# EAGLE design LaserPowerMeter (EAGLE 7.2.0)
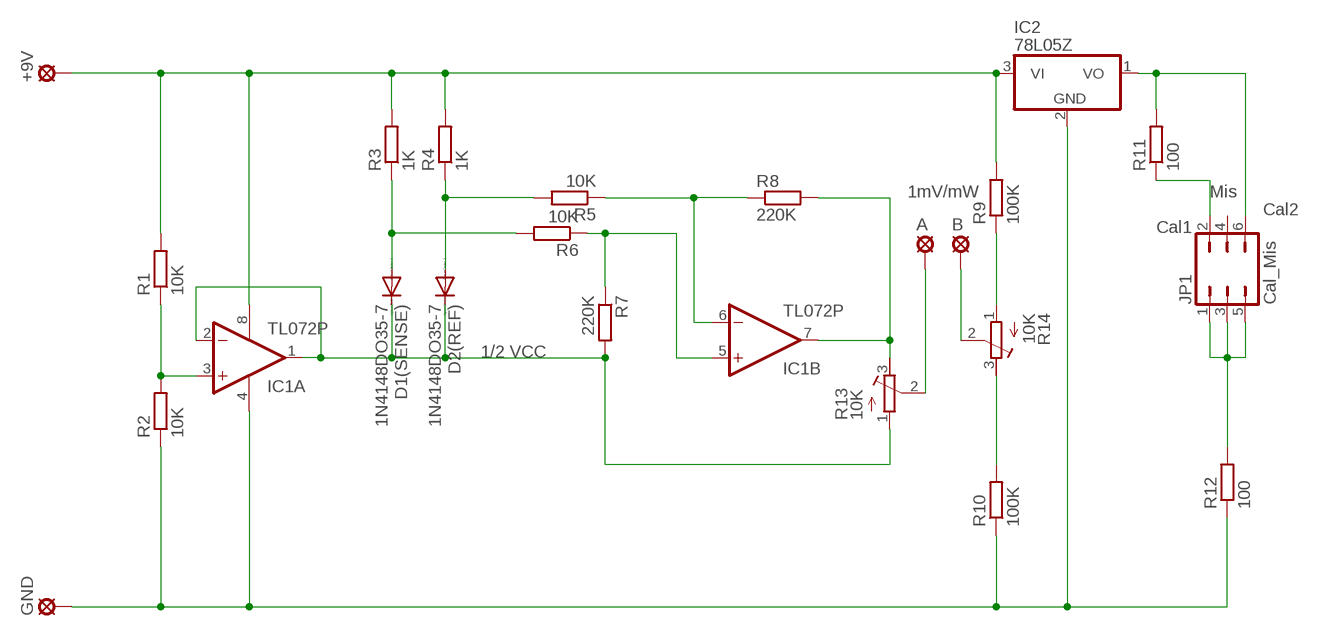
[diagram p0: schematic, sheet 1]

## Parts
+9V  LSP10  [LSP10]
A  LSP10  [LSP10]
B  LSP10  [LSP10]
D1(SENSE)  1N4148DO35-7  [DO35-7]
D2(REF)  1N4148DO35-7  [DO35-7]
GND  LSP10  [LSP10]
IC1  TL072P  [DIL08]
IC2  78L05Z  [TO92]
JP1  Cal_Mis  JP3Q  [JP3Q]
R1  10K  R-EU_0204/7  [0204/7]
R2  10K  R-EU_0204/7  [0204/7]
R3  1K  R-EU_0204/7  [0204/7]
R4  1K  R-EU_0204/7  [0204/7]
R5  10K  R-EU_0204/7  [0204/7]
R6  10K  R-EU_0204/7  [0204/7]
R7  220K  R-EU_0204/7  [0204/7]
R8  220K  R-EU_0204/7  [0204/7]
R9  100K  R-EU_0204/7  [0204/7]
R10  100K  R-EU_0204/7  [0204/7]
R11  100  R-EU_0204/7  [0204/7]
R12  100  R-EU_0204/7  [0204/7]
R13  10K  R-TRIMM3339P  [RTRIM3339P]
R14  10K  R-TRIMM3339P  [RTRIM3339P]

## Nets
N$2: JP1.1 JP1.3 JP1.5 R12.2
N$3: GND.MP IC1.4(P:V-) IC2.2(GND) R2.1 R10.1 R12.1
N$4: IC1.3(A:+IN) R1.1 R2.2
N$5: IC2.1(VO) JP1.6 R11.2
N$6: JP1.2 R11.1
N$7: +9V.MP IC1.8(P:V+) IC2.3(VI) R1.2 R3.2 R4.2 R9.2
N$8: R9.1 R14.1(A)
N$9: R10.2 R14.3(E)
N$10: A.MP R13.2(S)
N$11: B.MP R14.2(S)
N$12: IC1.7(B:OUT) R8.2 R13.3(E)
N$13: D1(SENSE).A R3.1 R6.2
N$14: D2(REF).A R4.1 R5.2
N$15: IC1.6(B:-IN) R5.1 R8.1
N$16: IC1.5(B:+IN) R6.1 R7.1
N$17: D1(SENSE).C D2(REF).C IC1.1(A:OUT) IC1.2(A:-IN) R7.2 R13.1(A)
Unconnected: JP1.4

## Notes on the sheet
- 1mV/mW | Mis
- Cal2
- Cal1
- 1/2 VCC

## Library data of the parts
+9V A B GND = solpad:LSP10: SOLDER PAD drill 1.0 mm, distributor Buerklin, 12H555
D1(SENSE) D2(REF) = diode:1N4148: DIODE high speed (Philips)
IC1 = linear:TL072: OP AMP
IC2 = linear:78*: Positive VOLTAGE REGULATOR Source: http://cache.national.com/ds/LM/LM78L05.pdf http://www.fairchildsemi.com/ds/LM/LM7805.pdf
JP1 = jumper:JP3Q: JUMPER
R1-R12 = rcl:R-EU_: RESISTOR, European symbol
R13 R14 = rcl:R-TRIMM: Trimm resistor

## Board
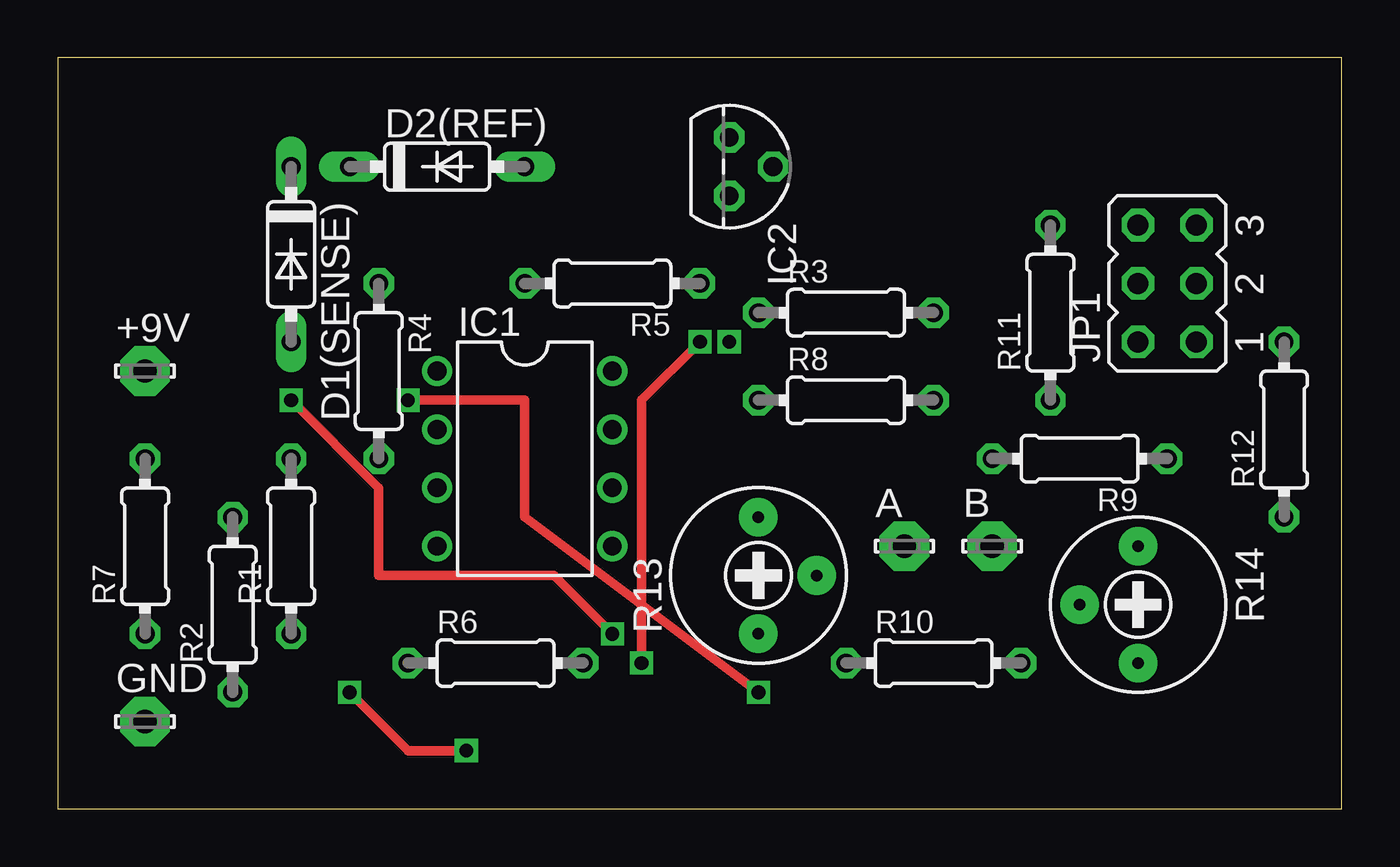
[diagram p1: board, top side]
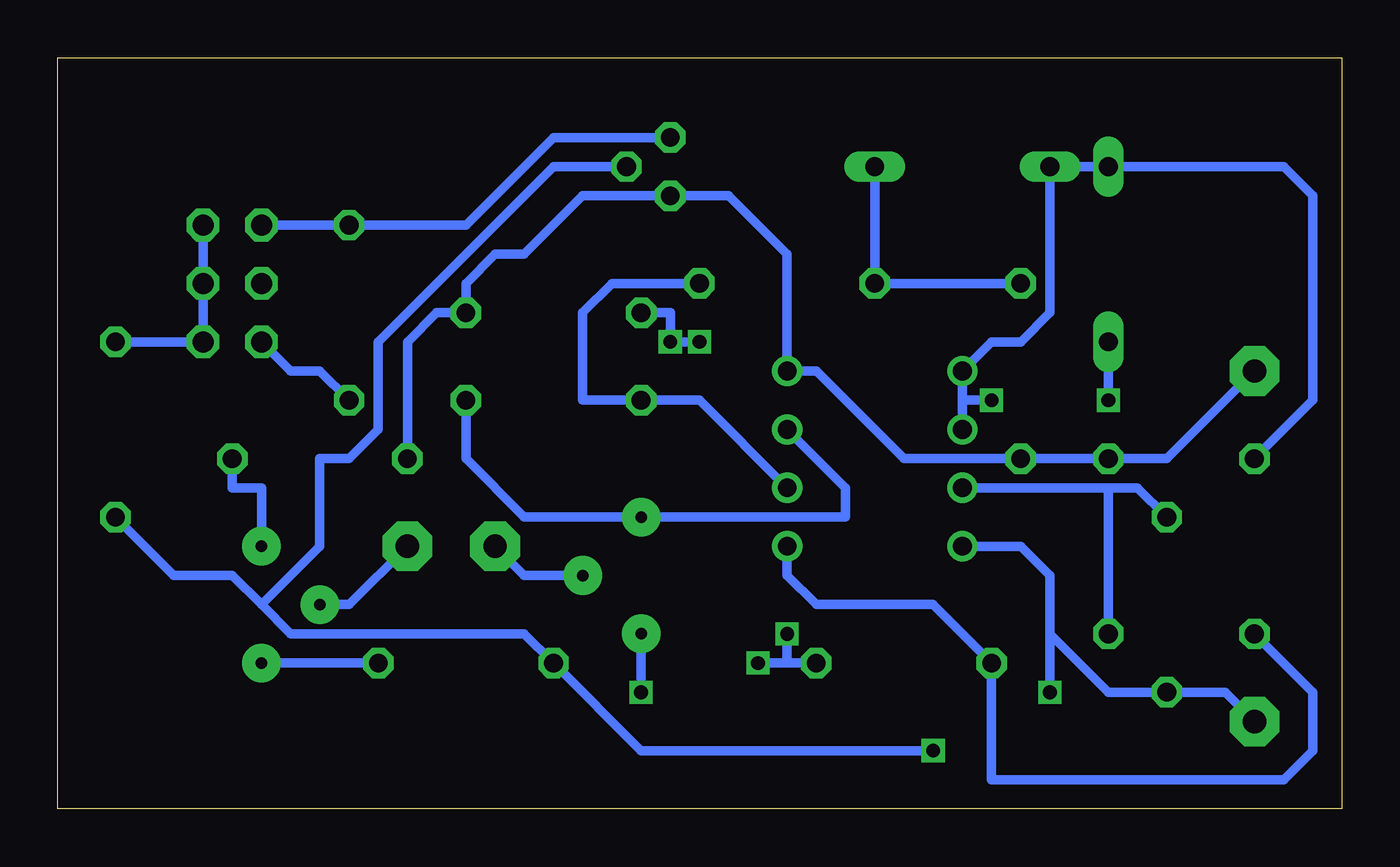
[diagram p2: board, bottom side, seen from below]

Size 55.86 x 32.69 mm. Coordinates in mm from the lower left corner, seen from the top.
Outline: 0,0 55.86,0 55.86,32.69 0,32.69 0,0
Copper layers (1*16): Top 0.035mm / dielectric 1.5mm / Bottom 0.035mm
Design rules "default": minimum track width 10mil, minimum drill 24mil, track to track 8mil, track to pad 8mil, pad to pad 8mil, via to via 8mil, smd to smd 8mil, copper to edge 40mil, drill to drill 8mil, minimum pad ring 10mil, minimum via ring 8mil, stop-mask expansion 4mil, vias tented up to drill 0mil, thermal gap 10mil

### Footprints (pad centres in the part's own frame; a part is rotated, then mirrored left to right if it is on the bottom)
LSP10 = drill 1.016 pad 2.159 octagon: MP 0,0
DO35-7 = drill 0.813 long: A 3.81,0; C -3.81,0
DIL08 = drill 0.813 pad 1.27: 1 -3.81,-3.81; 2 -1.27,-3.81; 3 1.27,-3.81; 4 3.81,-3.81; 5 3.81,3.81; 6 1.27,3.81; 7 -1.27,3.81; 8 -3.81,3.81
TO92 = drill 0.813 octagon: 1 -1.27,0; 2 0,1.905; 3 1.27,0
JP3Q = drill 0.914 octagon: 1 -2.54,-1.27; 2 -2.54,1.27; 3 0,-1.27; 4 0,1.27; 5 2.54,-1.27; 6 2.54,1.27
0204/7 = drill 0.813 octagon: 1 -3.81,0; 2 3.81,0
RTRIM3339P = drill 0.5 pad 1.676: 1 -2.54,0; 2 0,-2.54; 3 2.54,0

### Placement (x,y rotation side)
+9V  3.81,19.05 0 top
A  36.83,11.43 0 top
B  40.64,11.43 0 top
D1(SENSE)  10.16,24.13 270 top
D2(REF)  16.51,27.94 0 top
GND  3.81,3.81 0 top
IC1  20.32,15.24 270 top
IC2  29.21,27.94 270 top
JP1  48.26,22.86 90 top
R1  10.16,11.43 90 top
R2  7.62,8.89 90 top
R3  34.29,21.59 0 top
R4  13.97,19.05 270 top
R5  24.13,22.86 180 top
R6  19.05,6.35 0 top
R7  3.81,11.43 90 top
R8  34.29,17.78 0 top
R9  44.45,15.24 180 top
R10  38.1,6.35 0 top
R11  43.18,21.59 90 top
R12  53.34,16.51 90 top
R13  30.48,10.16 90 top
R14  46.99,8.89 270 top

### Tracks (layer width: path | path; a pad name or v marks a point on that pad's centre or on a via)
N$2
  Bottom 0.406: JP1.5 JP1.3 JP1.1 R12.2
N$3  (via drill 0.6)
  Top 0.406: v12.7,5.08 15.24,2.54 v17.78,2.54
  Bottom 0.406: 46.99,8.89 45.72,7.62 35.56,7.62 R10.1 30.48,2.54 v17.78,2.54 | 46.99,8.89 48.26,10.16 50.8,10.16 R12.1 | IC2.2 34.29,27.94 41.91,20.32 41.91,16.51 43.18,15.24 44.45,15.24 44.45,11.43 46.99,8.89 | GND.MP 5.08,5.08 R2.1 10.16,5.08 12.7,7.62 | 12.7,7.62 12.7,10.16 13.97,11.43 IC1.4 | 12.7,7.62 v12.7,5.08
N$4
  Bottom 0.406: R2.2 8.89,13.97 10.16,13.97 | 10.16,13.97 IC1.3 | R1.1 10.16,13.97
N$5
  Bottom 0.406: JP1.6 R11.2 38.1,25.4 34.29,29.21 IC2.1
N$6
  Bottom 0.406: R11.1 44.45,19.05 45.72,19.05 JP1.2
N$7
  Bottom 0.406: R9.2 40.64,20.32 39.37,21.59 R3.2 38.1,22.86 36.83,24.13 35.56,24.13 33.02,26.67 IC2.3 26.67,26.67 24.13,24.13 IC1.8 22.86,19.05 19.05,15.24 R4.2 R1.2 7.62,15.24 +9V.MP
N$8
  Bottom 0.406: R14.1 46.99,13.97 48.26,13.97 R9.1
N$9
  Bottom 0.406: R10.2 R14.3
N$10
  Bottom 0.406: R13.2 35.56,10.16 A.MP
N$11
  Bottom 0.406: B.MP 43.18,8.89 R14.2
N$12
  Bottom 0.406: R8.2 38.1,15.24 35.56,12.7 R13.3 21.59,12.7 21.59,13.97 IC1.7
N$13  (via drill 0.6)
  Top 0.406: v27.94,20.32 25.4,17.78 v25.4,6.35 | v10.16,17.78 13.97,13.97 13.97,10.16 21.59,10.16 v24.13,7.62
  Bottom 0.406: R6.2 24.13,6.35 | 24.13,6.35 v25.4,6.35 | D1(SENSE).A v10.16,17.78 | R3.1 29.21,21.59 v29.21,20.32 v27.94,20.32 | 24.13,6.35 v24.13,7.62
N$14
  Bottom 0.406: D2(REF).A R5.2 R4.1
N$15
  Bottom 0.406: R5.1 31.75,22.86 33.02,21.59 33.02,17.78 R8.1 27.94,17.78 IC1.6
N$16
  Bottom 0.406: IC1.5 24.13,10.16 22.86,8.89 17.78,8.89 R6.1 15.24,1.27 2.54,1.27 1.27,2.54 1.27,5.08 R7.1
N$17  (via drill 0.6)
  Top 0.406: v15.24,17.78 20.32,17.78 20.32,12.7 v30.48,5.08
  Bottom 0.406: IC1.2 16.51,17.78 | 16.51,17.78 IC1.1 15.24,20.32 13.97,20.32 12.7,21.59 D2(REF).C D1(SENSE).C 2.54,27.94 1.27,26.67 1.27,17.78 R7.2 | 16.51,17.78 v15.24,17.78 | v30.48,5.08 R13.1